# Altium schematic sheet stm32辉光钟.SchDoc
size A4; SheetNumber: 2; SheetTotal: 3
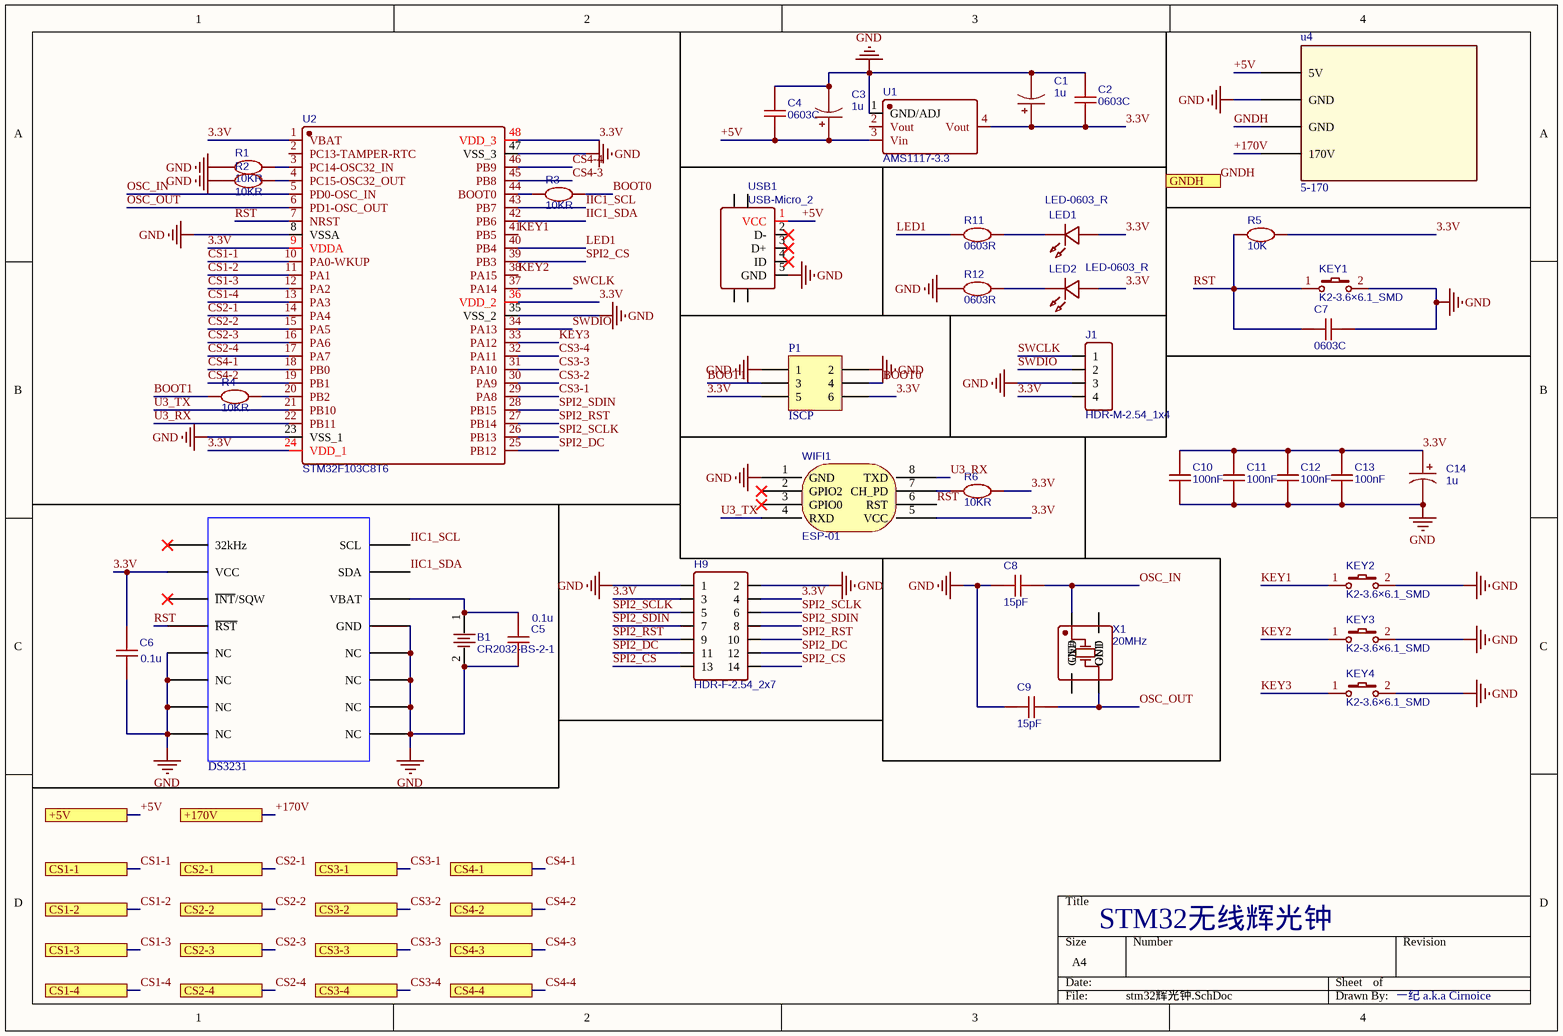
[diagram p0: stm32辉光钟.SchDoc]

## Parts
B1  CR2032-BS-2-1  [BAT-TH_BS-2-1]
C1  1u  [CASE-A_3216]
C2  0603C  [C0603]
C3  1u  [CASE-A_3216]
C4  0603C  [C0603]
C5  0.1u  [C0603]
C6  0.1u  [C0603]
C7  0603C  [C0603]
C8  15pF  [C0603]
C9  15pF  [C0603]
C10  100nF  [C0603]
C11  100nF  [C0603]
C12  100nF  [C0603]
C13  100nF  [C0603]
C14  1u  [CASE-A_3216]
ds1  DS3231  [DS3231]
H9  HDR-F-2.54_2x7  [HDR-F-2.54_2X7]
J1  HDR-M-2.54_1x4  [HDR-M-2.54_1X4]
KEY1  K2-3.6×6.1_SMD  [KEY-SMD_2P-L6.2-W3.6-LS8.0]
KEY2  K2-3.6×6.1_SMD  [KEY-SMD_2P-L6.2-W3.6-LS8.0]
KEY3  K2-3.6×6.1_SMD  [KEY-SMD_2P-L6.2-W3.6-LS8.0]
KEY4  K2-3.6×6.1_SMD  [KEY-SMD_2P-L6.2-W3.6-LS8.0]
LED1  LED-0603_R  [LED0603_RED]
LED2  LED-0603_R  [LED0603_RED]
P1  ISCP  [HDR2X3]
R1  10KR  [R0603]
R2  10KR  [R0603]
R3  10KR  [R0603]
R4  10KR  [R0603]
R5  10K  [R0603]
R6  10KR  [R0603]
R11  0603R  [R0603]
R12  0603R  [R0603]
U1  AMS1117-3.3  [SOT-223-3_L6.5-W3.4-P2.30-LS7.0-BR]
U2  STM32F103C8T6  [LQFP-48_L7.0-W7.0-P0.50-LS9.0-BL]
u4  5-170  [5-170V]
USB1  USB-Micro_2  [MICRO-USB-SMD_5P_C40957]
WIFI1  ESP-01  [ESP-01]
X1  20MHz  [CRYSTAL-SMD_4P-L3.2-W2.5-BL]

## Ports
+5V, +170V, CS1-1, CS1-2, CS1-3, CS1-4, CS2-1, CS2-2, CS2-3, CS2-4, CS3-1, CS3-2, CS3-3, CS3-4, CS4-1, CS4-2, CS4-3, CS4-4, GNDH

## Nets
GND: B1.2 C1.2 C2.2 C3.2 C4.2 C5.1 C6.1 C7.2 C8.1 C9.1 C10.1 C11.1 C12.1 C13.1 C14.2 ds1.5(NC) ds1.6(NC) ds1.7(NC) ds1.8(NC) ds1.9(NC) ds1.10(NC) ds1.11(NC) ds1.12(NC) ds1.13(GND) H9.1 H9.2 J1.3 KEY1.2 KEY2.2 KEY3.2 KEY4.2 P1.1 P1.2 R1.1 R2.1 R12.1 U1.1(GND/ADJ) U2.8(VSSA) U2.23(VSS_1) U2.35(VSS_2) U2.47(VSS_3) u4.2(GND) USB1.5(GND) WIFI1.1(GND)
3.3V: C1.1 C2.1 C6.2 C10.2 C11.2 C12.2 C13.2 C14.1 ds1.2(VCC) H9.3 H9.4 J1.4 LED1.1 LED2.1 P1.5 P1.6 R5.2 R6.2 U1.4(Vout) U2.1(VBAT) U2.9(VDDA) U2.24(VDD_1) U2.36(VDD_2) U2.48(VDD_3) WIFI1.5(VCC)
+5V: C3.1 C4.1 U1.3(Vin) u4.1(5V) USB1.1(VCC) ; port +5V
+170V: u4.4(170V) ; port +170V
BOOT0: P1.4 R3.2
BOOT1: P1.3 R4.1
CS1-1: U2.10(PA0-WKUP) ; port CS1-1
CS1-2: U2.11(PA1) ; port CS1-2
CS1-3: U2.12(PA2) ; port CS1-3
CS1-4: U2.13(PA3) ; port CS1-4
CS2-1: U2.14(PA4) ; port CS2-1
CS2-2: U2.15(PA5) ; port CS2-2
CS2-3: U2.16(PA6) ; port CS2-3
CS2-4: U2.17(PA7) ; port CS2-4
CS3-1: U2.29(PA8) ; port CS3-1
CS3-2: U2.30(PA9) ; port CS3-2
CS3-3: U2.31(PA10) ; port CS3-3
CS3-4: U2.32(PA11) ; port CS3-4
CS4-1: U2.18(PB0) ; port CS4-1
CS4-2: U2.19(PB1) ; port CS4-2
CS4-3: U2.45(PB8) ; port CS4-3
CS4-4: U2.46(PB9) ; port CS4-4
GNDH: u4.3(GND) ; port GNDH
IIC1_SCL: ds1.16(SCL) U2.43(PB7)
IIC1_SDA: ds1.15(SDA) U2.42(PB6)
KEY1: KEY2.1 U2.41(PB5)
KEY2: KEY3.1 U2.38(PA15)
KEY3: KEY4.1 U2.33(PA12)
LED1: R11.1 U2.40(PB4)
OSC_IN: C8.2 U2.5(PD0-OSC_IN) X1.1(OE#)
OSC_OUT: C9.2 U2.6(PD1-OSC_OUT) X1.3(OUT)
RST: C7.1 ds1.4(~{RST}) KEY1.1 R5.1 U2.7(NRST) WIFI1.6(RST)
SPI2_CS: H9.13 H9.14 U2.39(PB3)
SPI2_DC: H9.11 H9.12 U2.25(PB12)
SPI2_RST: H9.9 H9.10 U2.27(PB14)
SPI2_SCLK: H9.5 H9.6 U2.26(PB13)
SPI2_SDIN: H9.7 H9.8 U2.28(PB15)
SWCLK: J1.1 U2.37(PA14)
SWDIO: J1.2 U2.34(PA13)
U3_RX: U2.22(PB11) WIFI1.8(TXD)
U3_TX: U2.21(PB10) WIFI1.4(RXD)
NetB1_1: B1.1 C5.2 ds1.14(VBAT)
NetLED1_2: LED1.2 R11.2
NetLED2_2: LED2.2 R12.2
NetR1_2: R1.2 U2.3(PC14-OSC32_IN)
NetR2_2: R2.2 U2.4(PC15-OSC32_OUT)
NetR3_1: R3.1 U2.44(BOOT0)
NetR4_2: R4.2 U2.20(PB2)
NetR6_1: R6.1 WIFI1.7(CH_PD)

Not connected (* = marked no-connect by the designer): ds1 1(32kHz)* 3(~{INT}/SQW)*; U1 2(Vout); U2 2(PC13-TAMPER-RTC); USB1 2(D-)* 3(D+)* 4(ID)* 6(SH3) 7(SH4) 8(SH1) 9(SH2); WIFI1 2(GPIO2)* 3(GPIO0)*; X1 2(GND) 4(GND)

## Notes on the sheet
- STM32无线辉光钟
- 一纪 a.k.a Cirnoice

## Library data of the parts
B1 = CR2032-BS-2-1: BOM_Manufacturer: Q&J; BOM_Manufacturer Part: BS-2-1; BOM_Supplier: LCSC; BOM_Supplier Part: C70376; BOM_JLCPCB Part Class: Extended Part; spicePre: B; spiceSymbolName: CR2032-BS-2-1
C1 C3 C14 = 1u: nameAlias: Value(F); Contributor: LCEDA_Lib; spicePre: C; spiceSymbolName: C_Tan_SMD_A_US
C2 C4-C13 = 0603C: nameAlias: Value(F); Contributor: LCEDA_Lib; spicePre: C; spiceSymbolName: C_0603_US
H9 = HDR-F-2.54_2x7: Contributor: LCEDA_Lib; BOM_Supplier Part: C38844; BOM_Supplier: LCSC; spicePre: H; spiceSymbolName: HDR-F-2.54_2x7
J1 = HDR-M-2.54_1x4: Contributor: LCEDA_Lib; BOM_Supplier Part: C124378; BOM_Supplier: LCSC; spicePre: J; spiceSymbolName: HDR-M-2.54_1x4
KEY1-KEY4 = K2-3.6×6.1_SMD: BOM_Manufacturer Part: K2-1107ST-A4SW-06; Contributor: LCEDA_Lib; 制造商: 韩国韩荣; BOM_Supplier Part: C118141; BOM_Supplier: LCSC; spicePre: K; spiceSymbolName: K2-3.6×6.1_SMD
LED1 LED2 = LED-0603_R: BOM_Manufacturer: EVERLIGHT(台湾亿光); BOM_Manufacturer Part: 19-217/R6C-AL1M2VY/3T; Contributor: LCEDA_01; BOM_Supplier Part: C72044; BOM_Supplier: LCSC; spicePre: L; spiceSymbolName: LED-0603_R
P1 = Header 3X2: Header, 3-Pin, Dual row; LatestRevisionDate: 17-Jul-2002; LatestRevisionNote: Re-released for DXP Platform.; Publisher: Altium Limited
R1-R6 R11 R12 = 0603R: nameAlias: Value(Ω); Contributor: LCEDA_Lib; spicePre: R; spiceSymbolName: R_0603_EU
U1 = AMS1117-3.3: BOM_Manufacturer: AMS; sourceId: dwIGgezVh; timeStamp: 1476261164; BOM_Supplier: LCSC; BOM_Manufacturer Part: AMS1117-3.3; BOM_Supplier Part: C6186; BOM_JLCPCB Part Class: Basic Part; spicePre: U; spiceSymbolName: AMS1117-3.3
U2 = STM32F103C8T6: BOM_Manufacturer: STMicroelectronics; timeStamp: 1455028086; BOM_Supplier: LCSC; BOM_Manufacturer Part: STM32F103C8T6; BOM_Supplier Part: C8734; BOM_JLCPCB Part Class: Basic Part; spicePre: U; spiceSymbolName: STM32F103C8T6
USB1 = USB-Micro_2: BOM_Manufacturer: ValuePro; Contributor: LCEDA_Lib; BOM_Supplier Part: C40957; BOM_Supplier: LCSC; spicePre: U; spiceSymbolName: USB-Micro_2
WIFI1 = ESP-01: Contributor: jishuhai; spicePre: w; spiceSymbolName: ESP-01
X1 = 20MHz: BOM_Manufacturer: Zhejiang Abel Elec; BOM_Manufacturer Part: SMD-3225_4P20MHZ20PF10PPM; nameAlias: Frequency; Contributor: LCSC; BOM_Supplier: LCSC; BOM_Supplier Part: C172730; BOM_JLCPCB Part Class: Extended Part; spicePre: X; spiceSymbolName: SMD-3225_4P20MHZ20PF10PPM